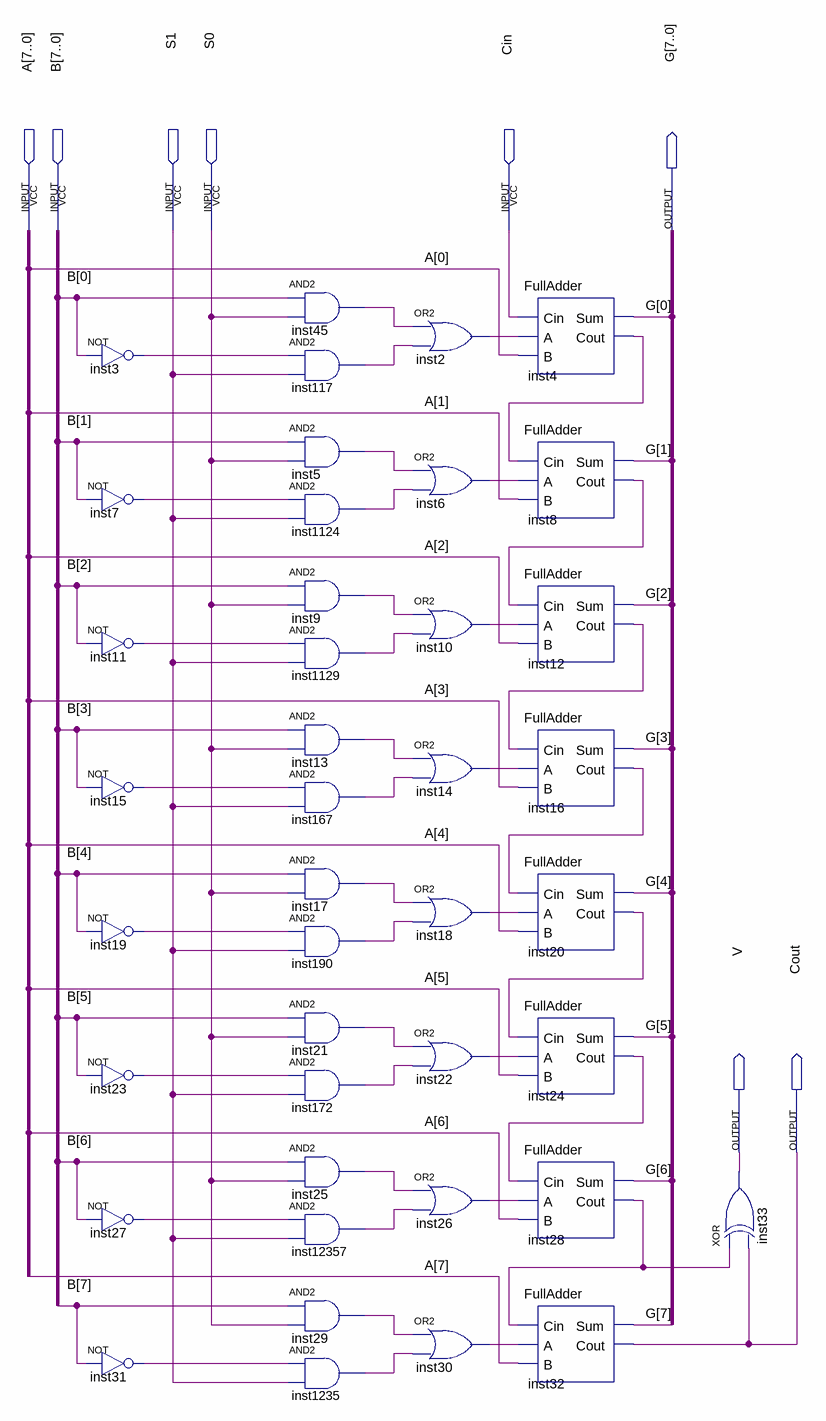
[diagram p0: schematic sheet]
// Quartus schematic ArithStage.bdf as structural Verilog: 41 symbols, 8 pins
module ArithStage (
  input  [7:0] A,
  input  [7:0] B,
  input  S1,
  input  S0,
  input  Cin,
  output [7:0] G,
  output V,
  output Cout
);

  wire inst2_out, inst3_out, inst4_cout, inst5_out, inst6_out, inst7_out, inst8_cout, inst9_out, inst10_out,
       inst11_out, inst12_cout, inst13_out, inst14_out, inst15_out, inst16_cout, inst17_out, inst18_out,
       inst19_out, inst20_cout, inst21_out, inst22_out, inst23_out, inst24_cout, inst25_out, inst26_out,
       inst27_out, inst28_cout, inst29_out, inst30_out, inst31_out, inst45_out, inst117_out, inst167_out,
       inst172_out, inst190_out, inst1124_out, inst1129_out, inst1235_out, inst12357_out;

  not inst3 (inst3_out, B[0]);
  not inst7 (inst7_out, B[1]);
  not inst11 (inst11_out, B[2]);
  not inst15 (inst15_out, B[3]);
  not inst19 (inst19_out, B[4]);
  not inst23 (inst23_out, B[5]);
  not inst27 (inst27_out, B[6]);
  not inst31 (inst31_out, B[7]);
  and inst45 (inst45_out, B[0], S0);
  and inst117 (inst117_out, inst3_out, S1);
  and inst5 (inst5_out, B[1], S0);
  and inst1124 (inst1124_out, inst7_out, S1);
  and inst9 (inst9_out, B[2], S0);
  and inst1129 (inst1129_out, inst11_out, S1);
  and inst13 (inst13_out, B[3], S0);
  and inst167 (inst167_out, inst15_out, S1);
  and inst17 (inst17_out, B[4], S0);
  and inst190 (inst190_out, inst19_out, S1);
  and inst21 (inst21_out, B[5], S0);
  and inst172 (inst172_out, inst23_out, S1);
  and inst25 (inst25_out, B[6], S0);
  and inst12357 (inst12357_out, inst27_out, S1);
  and inst29 (inst29_out, B[7], S0);
  and inst1235 (inst1235_out, inst31_out, S1);
  or inst2 (inst2_out, inst45_out, inst117_out);
  or inst6 (inst6_out, inst5_out, inst1124_out);
  or inst10 (inst10_out, inst9_out, inst1129_out);
  or inst14 (inst14_out, inst13_out, inst167_out);
  or inst18 (inst18_out, inst17_out, inst190_out);
  or inst22 (inst22_out, inst21_out, inst172_out);
  or inst26 (inst26_out, inst25_out, inst12357_out);
  or inst30 (inst30_out, inst29_out, inst1235_out);
  FullAdder inst4 (.Cin(Cin), .A(inst2_out), .B(A[0]), .Sum(G[0]), .Cout(inst4_cout));
  FullAdder inst8 (.Cin(inst4_cout), .A(inst6_out), .B(A[1]), .Sum(G[1]), .Cout(inst8_cout));
  FullAdder inst12 (.Cin(inst8_cout), .A(inst10_out), .B(A[2]), .Sum(G[2]), .Cout(inst12_cout));
  FullAdder inst16 (.Cin(inst12_cout), .A(inst14_out), .B(A[3]), .Sum(G[3]), .Cout(inst16_cout));
  FullAdder inst20 (.Cin(inst16_cout), .A(inst18_out), .B(A[4]), .Sum(G[4]), .Cout(inst20_cout));
  FullAdder inst24 (.Cin(inst20_cout), .A(inst22_out), .B(A[5]), .Sum(G[5]), .Cout(inst24_cout));
  FullAdder inst28 (.Cin(inst24_cout), .A(inst26_out), .B(A[6]), .Sum(G[6]), .Cout(inst28_cout));
  FullAdder inst32 (.Cin(inst28_cout), .A(inst30_out), .B(A[7]), .Sum(G[7]), .Cout(Cout));
  xor inst33 (V, inst28_cout, Cout);
endmodule
